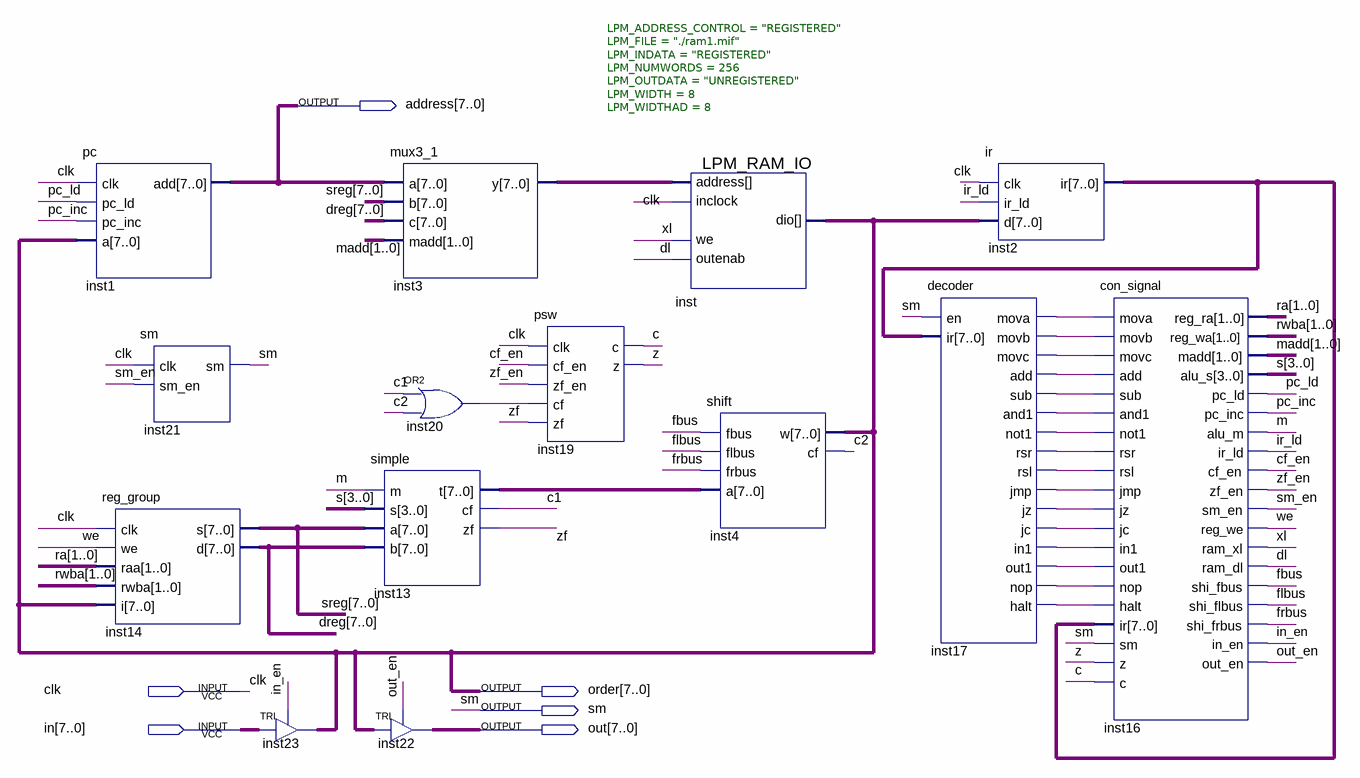
[diagram p0: schematic sheet]
// Quartus schematic small_computer.bdf as structural Verilog: 14 symbols, 6 pins
module small_computer (
  input  clk,
  input  [7:0] in,
  output [7:0] address,
  output [7:0] order,
  output sm,
  output [7:0] out
);

  wire c, c1, c2, cf_en, dl, fbus, flbus, frbus, in_en, inst17_add, inst17_and1, inst17_halt, inst17_in1,
       inst17_jc, inst17_jmp, inst17_jz, inst17_mova, inst17_movb, inst17_movc, inst17_nop, inst17_not1,
       inst17_out1, inst17_rsl, inst17_rsr, inst17_sub, inst20_out, ir_ld, m, out_en, pc_inc, pc_ld, sm_en,
       we, xl, z, zf, zf_en;
  wire [1:0] madd, ra, rwba;
  wire [3:0] s;
  wire [7:0] dreg, inst2_ir, inst3_y, inst13_t, sreg;

  pc inst1 (.clk(clk), .pc_ld(pc_ld), .pc_inc(pc_inc), .a(order), .add(address));
  sm inst21 (.clk(clk), .sm_en(sm_en), .sm(sm));
  reg_group inst14 (.clk(clk), .we(we), .raa(ra), .rwba(rwba), .i(order), .s(sreg), .d(dreg));
  TRI inst23[7:0] (.IN(in), .OE(in_en), .OUT(order));
  mux3_1 inst3 (.a(address), .b(sreg), .c(dreg), .madd(madd), .y(inst3_y));
  simple inst13 (.m(m), .s(s), .a(sreg), .b(dreg), .t(inst13_t), .cf(c1), .zf(zf));
  TRI inst22[7:0] (.IN(order), .OE(out_en), .OUT(out));
  or inst20 (inst20_out, c1, c2);
  psw inst19 (.clk(clk), .cf_en(cf_en), .zf_en(zf_en), .cf(inst20_out), .zf(zf), .c(c), .z(z));
  LPM_RAM_IO #(.LPM_ADDRESS_CONTROL("REGISTERED"), .LPM_FILE("./ram1.mif"), .LPM_INDATA("REGISTERED"), .LPM_NUMWORDS(256), .LPM_OUTDATA("UNREGISTERED"), .LPM_WIDTH(8), .LPM_WIDTHAD(8)) inst (
    .address(inst3_y), .inclock(clk), .we(xl), .outenab(dl), .dio(order));
  shift inst4 (.fbus(fbus), .flbus(flbus), .frbus(frbus), .a(inst13_t), .w(order), .cf(c2));
  decoder inst17 (
    .en(sm), .ir(inst2_ir), .mova(inst17_mova), .movb(inst17_movb), .movc(inst17_movc), .add(inst17_add),
    .sub(inst17_sub), .and1(inst17_and1), .not1(inst17_not1), .rsr(inst17_rsr), .rsl(inst17_rsl),
    .jmp(inst17_jmp), .jz(inst17_jz), .jc(inst17_jc), .in1(inst17_in1), .out1(inst17_out1), .nop(inst17_nop),
    .halt(inst17_halt));
  ir inst2 (.clk(clk), .ir_ld(ir_ld), .d(order), .ir(inst2_ir));
  con_signal inst16 (
    .mova(inst17_mova), .movb(inst17_movb), .movc(inst17_movc), .add(inst17_add), .sub(inst17_sub),
    .and1(inst17_and1), .not1(inst17_not1), .rsr(inst17_rsr), .rsl(inst17_rsl), .jmp(inst17_jmp),
    .jz(inst17_jz), .jc(inst17_jc), .in1(inst17_in1), .out1(inst17_out1), .nop(inst17_nop),
    .halt(inst17_halt), .ir(inst2_ir), .sm(sm), .z(z), .c(c), .reg_ra(ra), .reg_wa(rwba), .madd(madd),
    .alu_s(s), .pc_ld(pc_ld), .pc_inc(pc_inc), .alu_m(m), .ir_ld(ir_ld), .cf_en(cf_en), .zf_en(zf_en),
    .sm_en(sm_en), .reg_we(we), .ram_xl(xl), .ram_dl(dl), .shi_fbus(fbus), .shi_flbus(flbus),
    .shi_frbus(frbus), .in_en(in_en), .out_en(out_en));
endmodule
